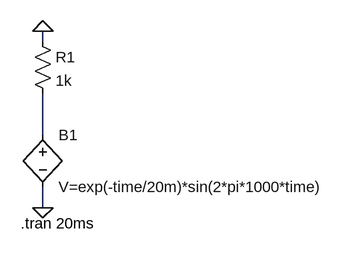
[diagram p0: schematic Draft1.asc]
Draft1.asc, the LTspice schematic file:
Version 4
SHEET 1 880 680
WIRE 112 -48 112 -64
WIRE 112 96 112 32
WIRE 112 208 112 176
FLAG 112 208 0
FLAG 112 -64 0
SYMBOL res 96 -64 R0
SYMATTR InstName R1
SYMATTR Value 1k
SYMBOL bv 112 80 R0
SYMATTR InstName B1
SYMATTR Value V=exp(-time/20m)*sin(2*pi*1000*time)
TEXT 78 232 Left 2 !.tran 20ms

The netlist it stands for:
* Draft1.asc
R1 0 N001 1k
B1 N001 0 V=exp(-time/20m)*sin(2*pi*1000*time)
.tran 20ms
.backanno
.end